# Altium schematic sheet 单片机电路.SchDoc
size A4
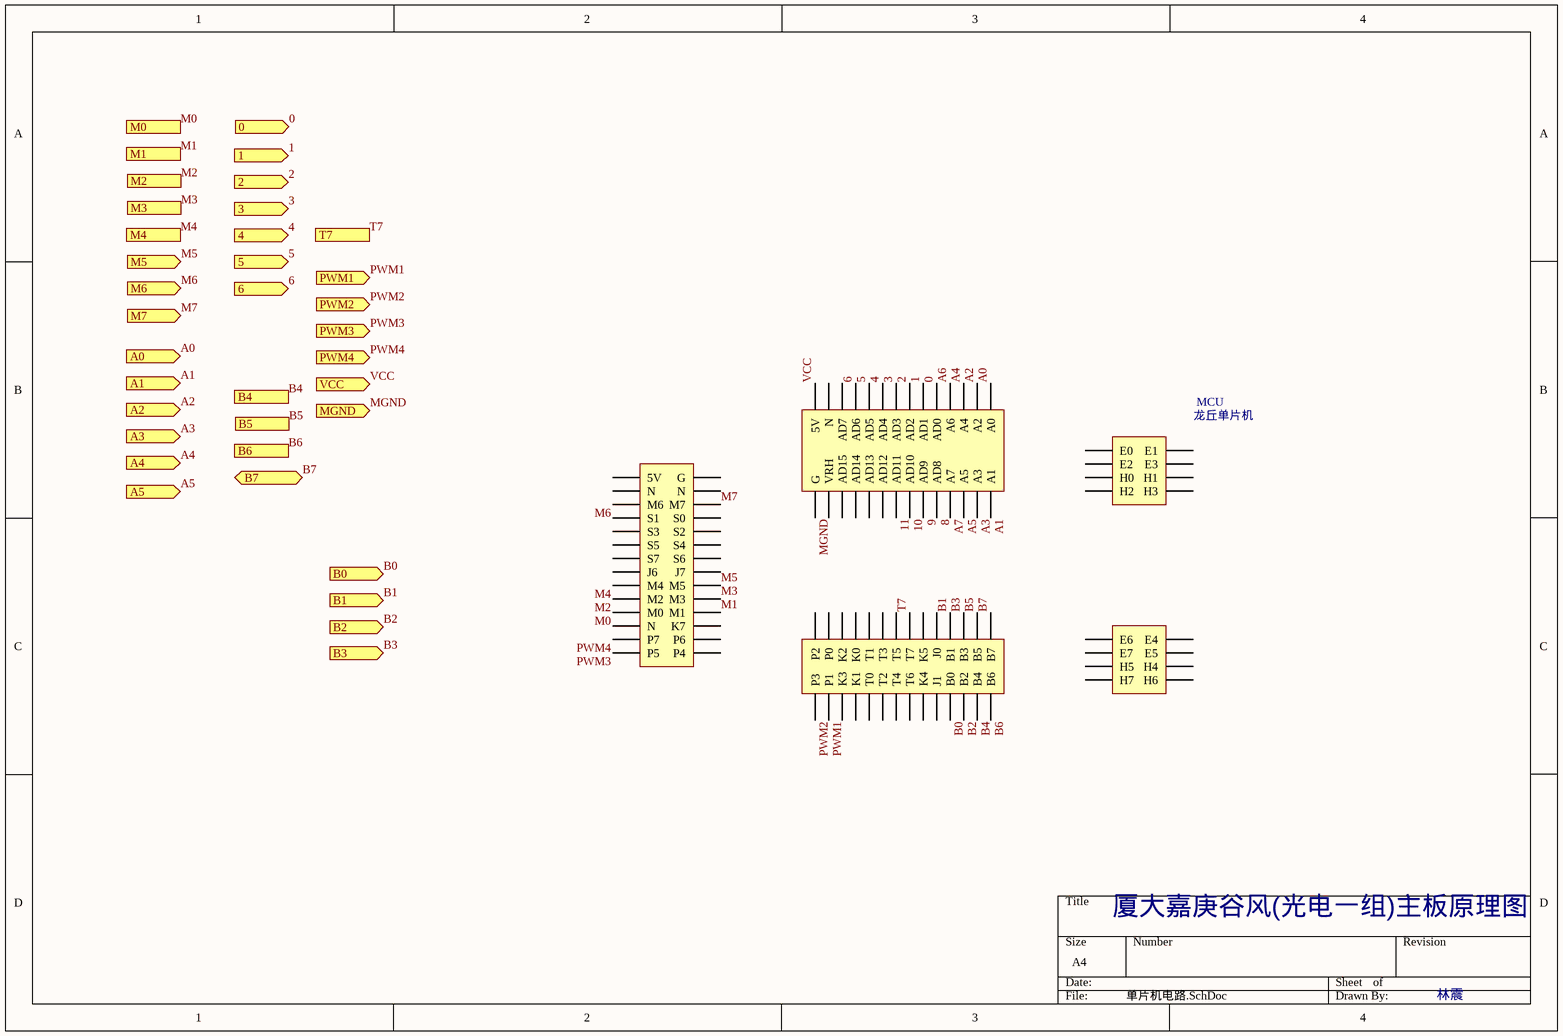
[diagram p0: 单片机电路.SchDoc]

## Parts
MCU  龙丘单片机  [LQ_112_BOARD]

## Ports
0 (out), 1 (out), 2 (out), 3 (out), 4 (out), 5 (out), 6 (out), A0 (out), A1 (out), A2 (out), A3 (out), A4 (out), A5 (out), B0 (in), B1 (in), B2 (in), B3 (in), B4 (in), B5 (in), B6 (in), B7 (out), M0, M1, M2, M3, M4, M5 (in), M6 (in), M7 (in), MGND (in), PWM1 (out), PWM2 (out), PWM3 (out), PWM4 (out), T7, VCC (in)

## Nets
0: MCU.309(AD0) ; port 0
1: MCU.311(AD1) ; port 1
2: MCU.313(AD2) ; port 2
3: MCU.315(AD3) ; port 3
4: MCU.317(AD4) ; port 4
5: MCU.319(AD5) ; port 5
6: MCU.321(AD6) ; port 6
8: MCU.310(AD8)
9: MCU.312(AD9)
10: MCU.314(AD10)
11: MCU.316(AD11)
A0: MCU.301(A0) ; port A0
A1: MCU.302(A1) ; port A1
A2: MCU.303(A2) ; port A2
A3: MCU.304(A3) ; port A3
A4: MCU.305(A4) ; port A4
A5: MCU.306(A5) ; port A5
A6: MCU.307(A6)
A7: MCU.308(A7)
B0: MCU.121(B0) ; port B0
B1: MCU.122(B1) ; port B1
B2: MCU.123(B2) ; port B2
B3: MCU.124(B3) ; port B3
B4: MCU.125(B4) ; port B4
B5: MCU.126(B5) ; port B5
B6: MCU.127(B6) ; port B6
B7: MCU.128(B7) ; port B7
M0: MCU.221(M0) ; port M0
M1: MCU.222(M1) ; port M1
M2: MCU.219(M2) ; port M2
M3: MCU.220(M3) ; port M3
M4: MCU.217(M4) ; port M4
M5: MCU.218(M5) ; port M5
M6: MCU.205(M6) ; port M6
M7: MCU.206(M7) ; port M7
MGND: MCU.328(G) ; port MGND
PWM1: MCU.103(P1) ; port PWM1
PWM2: MCU.101(P3) ; port PWM2
PWM3: MCU.227(P5) ; port PWM3
PWM4: MCU.225(P7) ; port PWM4
T7: MCU.116(T7) ; port T7
VCC: MCU.327(5V) ; port VCC

Not connected (* = marked no-connect by the designer): MCU 102(P2) 104(P0) 105(K3) 106(K2) 107(K1) 108(K0) 109(T0) 110(T1) 111(T2) 112(T3) 113(T4) 114(T5) 115(T6) 117(K4) 118(K5) 119(J1) 120(J0) 201(5V) 202(G) 203(N) 204(N) 207(S1) 208(S0) 209(S3) 210(S2) 211(S5) 212(S4) 213(S7) 214(S6) 215(J6) 216(J7) 223(N) 224(K7) 226(P6) 228(P4) 318(AD12) 320(AD13) 322(AD14) 323(AD7) 324(AD15) 325(N) 326(VRH) 401(H6) 402(H7) 403(H4) 404(H5) 405(E5) 406(E7) 407(E4) 408(E6) 501(H3) 502(H2) 503(H1) 504(H0) 505(E3) 506(E2) 507(E1) 508(E0)

## Notes on the sheet
- 厦大嘉庚谷风(光电一组)主板原理图
- 林震

## Library data of the parts
MCU = LQ_112_BOARD